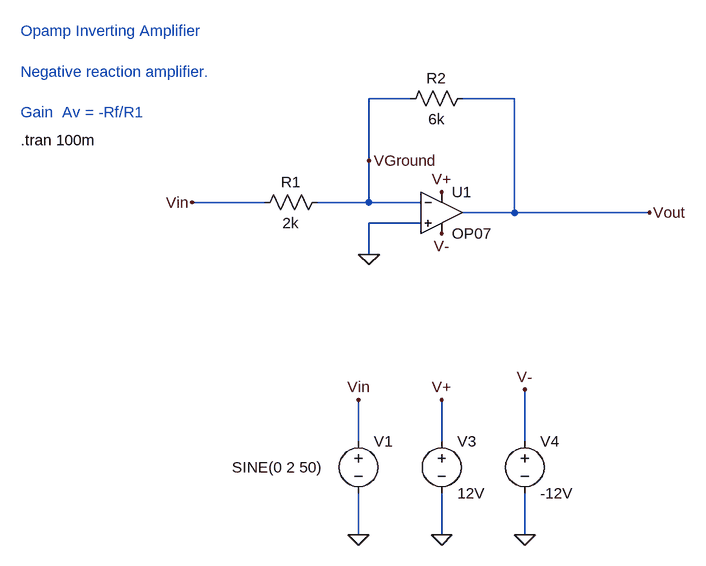
[diagram p0: schematic opamp_inverting_amplifier.asc]
opamp_inverting_amplifier.asc, the LTspice schematic file:
Version 4
SHEET 1 880 680
WIRE 112 -336 48 -336
WIRE 272 -336 192 -336
WIRE 48 -240 48 -336
WIRE -112 -176 -224 -176
WIRE 48 -176 48 -240
WIRE 48 -176 -32 -176
WIRE 128 -176 48 -176
WIRE 272 -160 272 -336
WIRE 272 -160 192 -160
WIRE 480 -160 272 -160
WIRE 128 -144 48 -144
WIRE 160 -128 160 -144
WIRE 48 -96 48 -144
WIRE 32 192 32 128
WIRE 160 192 160 128
WIRE 288 192 288 112
WIRE 32 336 32 272
WIRE 160 336 160 272
WIRE 288 336 288 272
FLAG 32 336 0
FLAG 160 336 0
FLAG 288 336 0
FLAG 160 128 V+
FLAG 288 112 V-
FLAG 160 -192 V+
FLAG 32 128 Vin
FLAG 480 -160 Vout
FLAG -224 -176 Vin
FLAG 48 -96 0
FLAG 48 -240 VGround
FLAG 160 -128 V-
SYMBOL voltage 32 176 R0
WINDOW 123 0 0 Left 0
WINDOW 39 0 0 Left 0
WINDOW 3 -195 56 Left 2
SYMATTR InstName V1
SYMATTR Value SINE(0 2 50)
SYMBOL OpAmps\\OP07 160 -224 R0
SYMATTR InstName U1
SYMBOL voltage 160 176 R0
WINDOW 123 0 0 Left 0
WINDOW 39 0 0 Left 0
SYMATTR InstName V3
SYMATTR Value 12V
SYMBOL voltage 288 176 R0
WINDOW 123 0 0 Left 0
WINDOW 39 0 0 Left 0
SYMATTR InstName V4
SYMATTR Value -12V
SYMBOL res -16 -192 R90
WINDOW 0 0 56 VBottom 2
WINDOW 3 32 56 VTop 2
SYMATTR InstName R1
SYMATTR Value 2k
SYMBOL res 208 -352 R90
WINDOW 0 0 56 VBottom 2
WINDOW 3 32 56 VTop 2
SYMATTR InstName R2
SYMATTR Value 6k
TEXT -488 -272 Left 2 !.tran 100m
TEXT -488 -440 Left 2 ;Opamp Inverting Amplifier\n \nNegative reaction amplifier.\n \nGain  Av = -Rf/R1

The netlist it stands for:
* opamp_inverting_amplifier.asc
V1 Vin 0 SINE(0 2 50)
XU1 0 VGround V+ V- Vout LT1001  ; OP07, pins In+ In- V+ V- OUT
V3 V+ 0 12V
V4 V- 0 -12V
R1 VGround Vin 2k
R2 Vout VGround 6k
.tran 100m
* Opamp Inverting Amplifier
* Negative reaction amplifier.
* Gain  Av = -Rf/R1
.lib LTC.lib
.backanno
.end